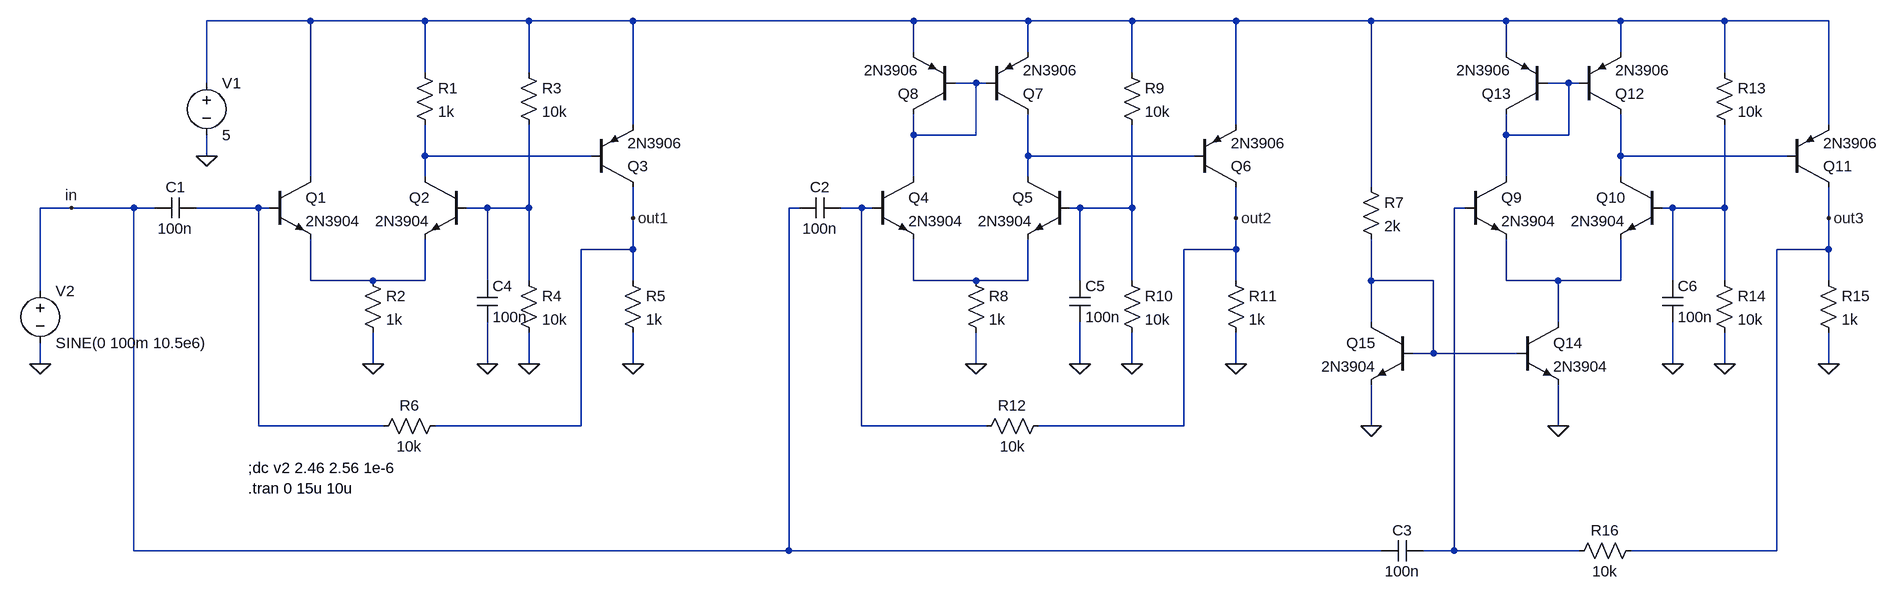
[diagram p0: schematic discrete.asc]
discrete.asc, the LTspice schematic file:
Version 4
SHEET 1 2804 800
WIRE 192 -64 32 -64
WIRE 368 -64 192 -64
WIRE 528 -64 368 -64
WIRE 688 -64 528 -64
WIRE 1120 -64 688 -64
WIRE 1296 -64 1120 -64
WIRE 1456 -64 1296 -64
WIRE 1616 -64 1456 -64
WIRE 1824 -64 1616 -64
WIRE 2032 -64 1824 -64
WIRE 2208 -64 2032 -64
WIRE 2368 -64 2208 -64
WIRE 2528 -64 2368 -64
WIRE 1120 -16 1120 -64
WIRE 1296 -16 1296 -64
WIRE 2032 -16 2032 -64
WIRE 2208 -16 2208 -64
WIRE 368 16 368 -64
WIRE 528 16 528 -64
WIRE 1456 16 1456 -64
WIRE 2368 16 2368 -64
WIRE 32 32 32 -64
WIRE 1216 32 1184 32
WIRE 1232 32 1216 32
WIRE 2128 32 2096 32
WIRE 2144 32 2128 32
WIRE 688 96 688 -64
WIRE 1616 96 1616 -64
WIRE 2528 96 2528 -64
WIRE 1120 112 1120 80
WIRE 1216 112 1216 32
WIRE 1216 112 1120 112
WIRE 2032 112 2032 80
WIRE 2128 112 2128 32
WIRE 2128 112 2032 112
WIRE 32 144 32 112
WIRE 368 144 368 96
WIRE 624 144 368 144
WIRE 1296 144 1296 80
WIRE 1552 144 1296 144
WIRE 2208 144 2208 80
WIRE 2464 144 2208 144
WIRE 192 176 192 -64
WIRE 368 176 368 144
WIRE 1120 176 1120 112
WIRE 1296 176 1296 144
WIRE 2032 176 2032 112
WIRE 2208 176 2208 144
WIRE 1824 192 1824 -64
WIRE -176 224 -224 224
WIRE -80 224 -176 224
WIRE -48 224 -80 224
WIRE 112 224 16 224
WIRE 128 224 112 224
WIRE 464 224 432 224
WIRE 528 224 528 96
WIRE 528 224 464 224
WIRE 944 224 928 224
WIRE 1040 224 1008 224
WIRE 1056 224 1040 224
WIRE 1376 224 1360 224
WIRE 1456 224 1456 96
WIRE 1456 224 1376 224
WIRE 1968 224 1952 224
WIRE 2288 224 2272 224
WIRE 2368 224 2368 96
WIRE 2368 224 2288 224
WIRE 688 240 688 192
WIRE 1616 240 1616 192
WIRE 2528 240 2528 192
WIRE 688 288 688 240
WIRE 688 288 608 288
WIRE 1616 288 1616 240
WIRE 1616 288 1536 288
WIRE 2528 288 2528 240
WIRE 2528 288 2448 288
WIRE 192 336 192 272
WIRE 288 336 192 336
WIRE 368 336 368 272
WIRE 368 336 288 336
WIRE 464 336 464 224
WIRE 528 336 528 224
WIRE 688 336 688 288
WIRE 1120 336 1120 272
WIRE 1216 336 1120 336
WIRE 1296 336 1296 272
WIRE 1296 336 1216 336
WIRE 1376 336 1376 224
WIRE 1456 336 1456 224
WIRE 1616 336 1616 288
WIRE 1824 336 1824 272
WIRE 1920 336 1824 336
WIRE 2032 336 2032 272
WIRE 2112 336 2032 336
WIRE 2208 336 2208 272
WIRE 2208 336 2112 336
WIRE 2288 336 2288 224
WIRE 2368 336 2368 224
WIRE 2528 336 2528 288
WIRE -224 352 -224 224
WIRE 1824 400 1824 336
WIRE 2112 400 2112 336
WIRE 1920 448 1920 336
WIRE 1920 448 1888 448
WIRE 2048 448 1920 448
WIRE -224 464 -224 432
WIRE 288 464 288 416
WIRE 464 464 464 400
WIRE 528 464 528 416
WIRE 688 464 688 416
WIRE 1216 464 1216 416
WIRE 1376 464 1376 400
WIRE 1456 464 1456 416
WIRE 1616 464 1616 416
WIRE 2288 464 2288 400
WIRE 2368 464 2368 416
WIRE 2528 464 2528 416
WIRE 112 560 112 224
WIRE 304 560 112 560
WIRE 608 560 608 288
WIRE 608 560 384 560
WIRE 1040 560 1040 224
WIRE 1232 560 1040 560
WIRE 1536 560 1536 288
WIRE 1536 560 1312 560
WIRE 1824 560 1824 496
WIRE 2112 560 2112 496
WIRE -80 752 -80 224
WIRE 928 752 928 224
WIRE 928 752 -80 752
WIRE 1840 752 928 752
WIRE 1952 752 1952 224
WIRE 1952 752 1904 752
WIRE 2144 752 1952 752
WIRE 2448 752 2448 288
WIRE 2448 752 2224 752
FLAG 32 144 0
FLAG -224 464 0
FLAG 288 464 0
FLAG 528 464 0
FLAG 688 464 0
FLAG 1216 464 0
FLAG 1456 464 0
FLAG 1616 464 0
FLAG -176 224 in
FLAG 688 240 out1
FLAG 1616 240 out2
FLAG 2368 464 0
FLAG 2528 464 0
FLAG 2528 240 out3
FLAG 1824 560 0
FLAG 2112 560 0
FLAG 464 464 0
FLAG 1376 464 0
FLAG 2288 464 0
SYMBOL voltage 32 16 R0
SYMATTR InstName V1
SYMATTR Value 5
SYMBOL npn 128 176 R0
SYMATTR InstName Q1
SYMATTR Value 2N3904
SYMBOL npn 432 176 M0
SYMATTR InstName Q2
SYMATTR Value 2N3904
SYMBOL res 352 0 R0
SYMATTR InstName R1
SYMATTR Value 1k
SYMBOL res 272 320 R0
SYMATTR InstName R2
SYMATTR Value 1k
SYMBOL res 512 0 R0
SYMATTR InstName R3
SYMATTR Value 10k
SYMBOL res 512 320 R0
SYMATTR InstName R4
SYMATTR Value 10k
SYMBOL voltage -224 336 R0
WINDOW 123 0 0 Left 0
WINDOW 39 0 0 Left 0
SYMATTR InstName V2
SYMATTR Value SINE(0 100m 10.5e6)
SYMBOL res 672 320 R0
SYMATTR InstName R5
SYMATTR Value 1k
SYMBOL res 400 544 R90
WINDOW 0 0 56 VBottom 2
WINDOW 3 32 56 VTop 2
SYMATTR InstName R6
SYMATTR Value 10k
SYMBOL pnp 624 192 M180
SYMATTR InstName Q3
SYMATTR Value 2N3906
SYMBOL npn 1056 176 R0
SYMATTR InstName Q4
SYMATTR Value 2N3904
SYMBOL npn 1360 176 M0
SYMATTR InstName Q5
SYMATTR Value 2N3904
SYMBOL res 1200 320 R0
SYMATTR InstName R8
SYMATTR Value 1k
SYMBOL res 1440 0 R0
SYMATTR InstName R9
SYMATTR Value 10k
SYMBOL res 1440 320 R0
SYMATTR InstName R10
SYMATTR Value 10k
SYMBOL res 1600 320 R0
SYMATTR InstName R11
SYMATTR Value 1k
SYMBOL res 1328 544 R90
WINDOW 0 0 56 VBottom 2
WINDOW 3 32 56 VTop 2
SYMATTR InstName R12
SYMATTR Value 10k
SYMBOL pnp 1552 192 M180
SYMATTR InstName Q6
SYMATTR Value 2N3906
SYMBOL pnp 1232 80 M180
SYMATTR InstName Q7
SYMATTR Value 2N3906
SYMBOL pnp 1184 80 R180
SYMATTR InstName Q8
SYMATTR Value 2N3906
SYMBOL npn 1968 176 R0
SYMATTR InstName Q9
SYMATTR Value 2N3904
SYMBOL npn 2272 176 M0
SYMATTR InstName Q10
SYMATTR Value 2N3904
SYMBOL res 2352 0 R0
SYMATTR InstName R13
SYMATTR Value 10k
SYMBOL res 2352 320 R0
SYMATTR InstName R14
SYMATTR Value 10k
SYMBOL res 2512 320 R0
SYMATTR InstName R15
SYMATTR Value 1k
SYMBOL res 2240 736 R90
WINDOW 0 0 56 VBottom 2
WINDOW 3 32 56 VTop 2
SYMATTR InstName R16
SYMATTR Value 10k
SYMBOL pnp 2464 192 M180
SYMATTR InstName Q11
SYMATTR Value 2N3906
SYMBOL pnp 2144 80 M180
SYMATTR InstName Q12
SYMATTR Value 2N3906
SYMBOL pnp 2096 80 R180
SYMATTR InstName Q13
SYMATTR Value 2N3906
SYMBOL npn 2048 400 R0
SYMATTR InstName Q14
SYMATTR Value 2N3904
SYMBOL npn 1888 400 M0
SYMATTR InstName Q15
SYMATTR Value 2N3904
SYMBOL res 1808 176 R0
SYMATTR InstName R7
SYMATTR Value 2k
SYMBOL cap 16 208 R90
WINDOW 0 0 32 VBottom 2
WINDOW 3 32 32 VTop 2
SYMATTR InstName C1
SYMATTR Value 100n
SYMBOL cap 1008 208 R90
WINDOW 0 0 32 VBottom 2
WINDOW 3 32 32 VTop 2
SYMATTR InstName C2
SYMATTR Value 100n
SYMBOL cap 1904 736 R90
WINDOW 0 0 32 VBottom 2
WINDOW 3 32 32 VTop 2
SYMATTR InstName C3
SYMATTR Value 100n
SYMBOL cap 448 336 R0
SYMATTR InstName C4
SYMATTR Value 100n
SYMBOL cap 1360 336 R0
SYMATTR InstName C5
SYMATTR Value 100n
SYMBOL cap 2272 336 R0
SYMATTR InstName C6
SYMATTR Value 100n
TEXT 96 624 Left 2 !;dc v2 2.46 2.56 1e-6
TEXT 96 656 Left 2 !.tran 0 15u 10u

The netlist it stands for:
* discrete.asc
V1 N001 0 5
Q1 N001 N007 N013 0 2N3904
Q2 N004 N008 N013 0 2N3904
R1 N001 N004 1k
R2 N013 0 1k
R3 N001 N008 10k
R4 N008 0 10k
V2 in 0 SINE(0 100m 10.5e6)
R5 out1 0 1k
R6 out1 N007 10k
Q3 out1 N004 N001 0 2N3906
Q4 N002 N009 N014 0 2N3904
Q5 N005 N010 N014 0 2N3904
R8 N014 0 1k
R9 N001 N010 10k
R10 N010 0 10k
R11 out2 0 1k
R12 out2 N009 10k
Q6 out2 N005 N001 0 2N3906
Q7 N005 N002 N001 0 2N3906
Q8 N002 N002 N001 0 2N3906
Q9 N003 N011 N016 0 2N3904
Q10 N006 N012 N016 0 2N3904
R13 N001 N012 10k
R14 N012 0 10k
R15 out3 0 1k
R16 out3 N011 10k
Q11 out3 N006 N001 0 2N3906
Q12 N006 N003 N001 0 2N3906
Q13 N003 N003 N001 0 2N3906
Q14 N016 N015 0 0 2N3904
Q15 N015 N015 0 0 2N3904
R7 N001 N015 2k
C1 N007 in 100n
C2 N009 in 100n
C3 N011 in 100n
C4 N008 0 100n
C5 N010 0 100n
C6 N012 0 100n
.model NPN NPN
.model PNP PNP
.lib standard.bjt
;dc v2 2.46 2.56 1e-6
.tran 0 15u 10u
.backanno
.end